# EAGLE design experimental_substrate (EAGLE 9.6.2)
REV: p2; TITLE: Wizard-Architect's Experimental Substrate
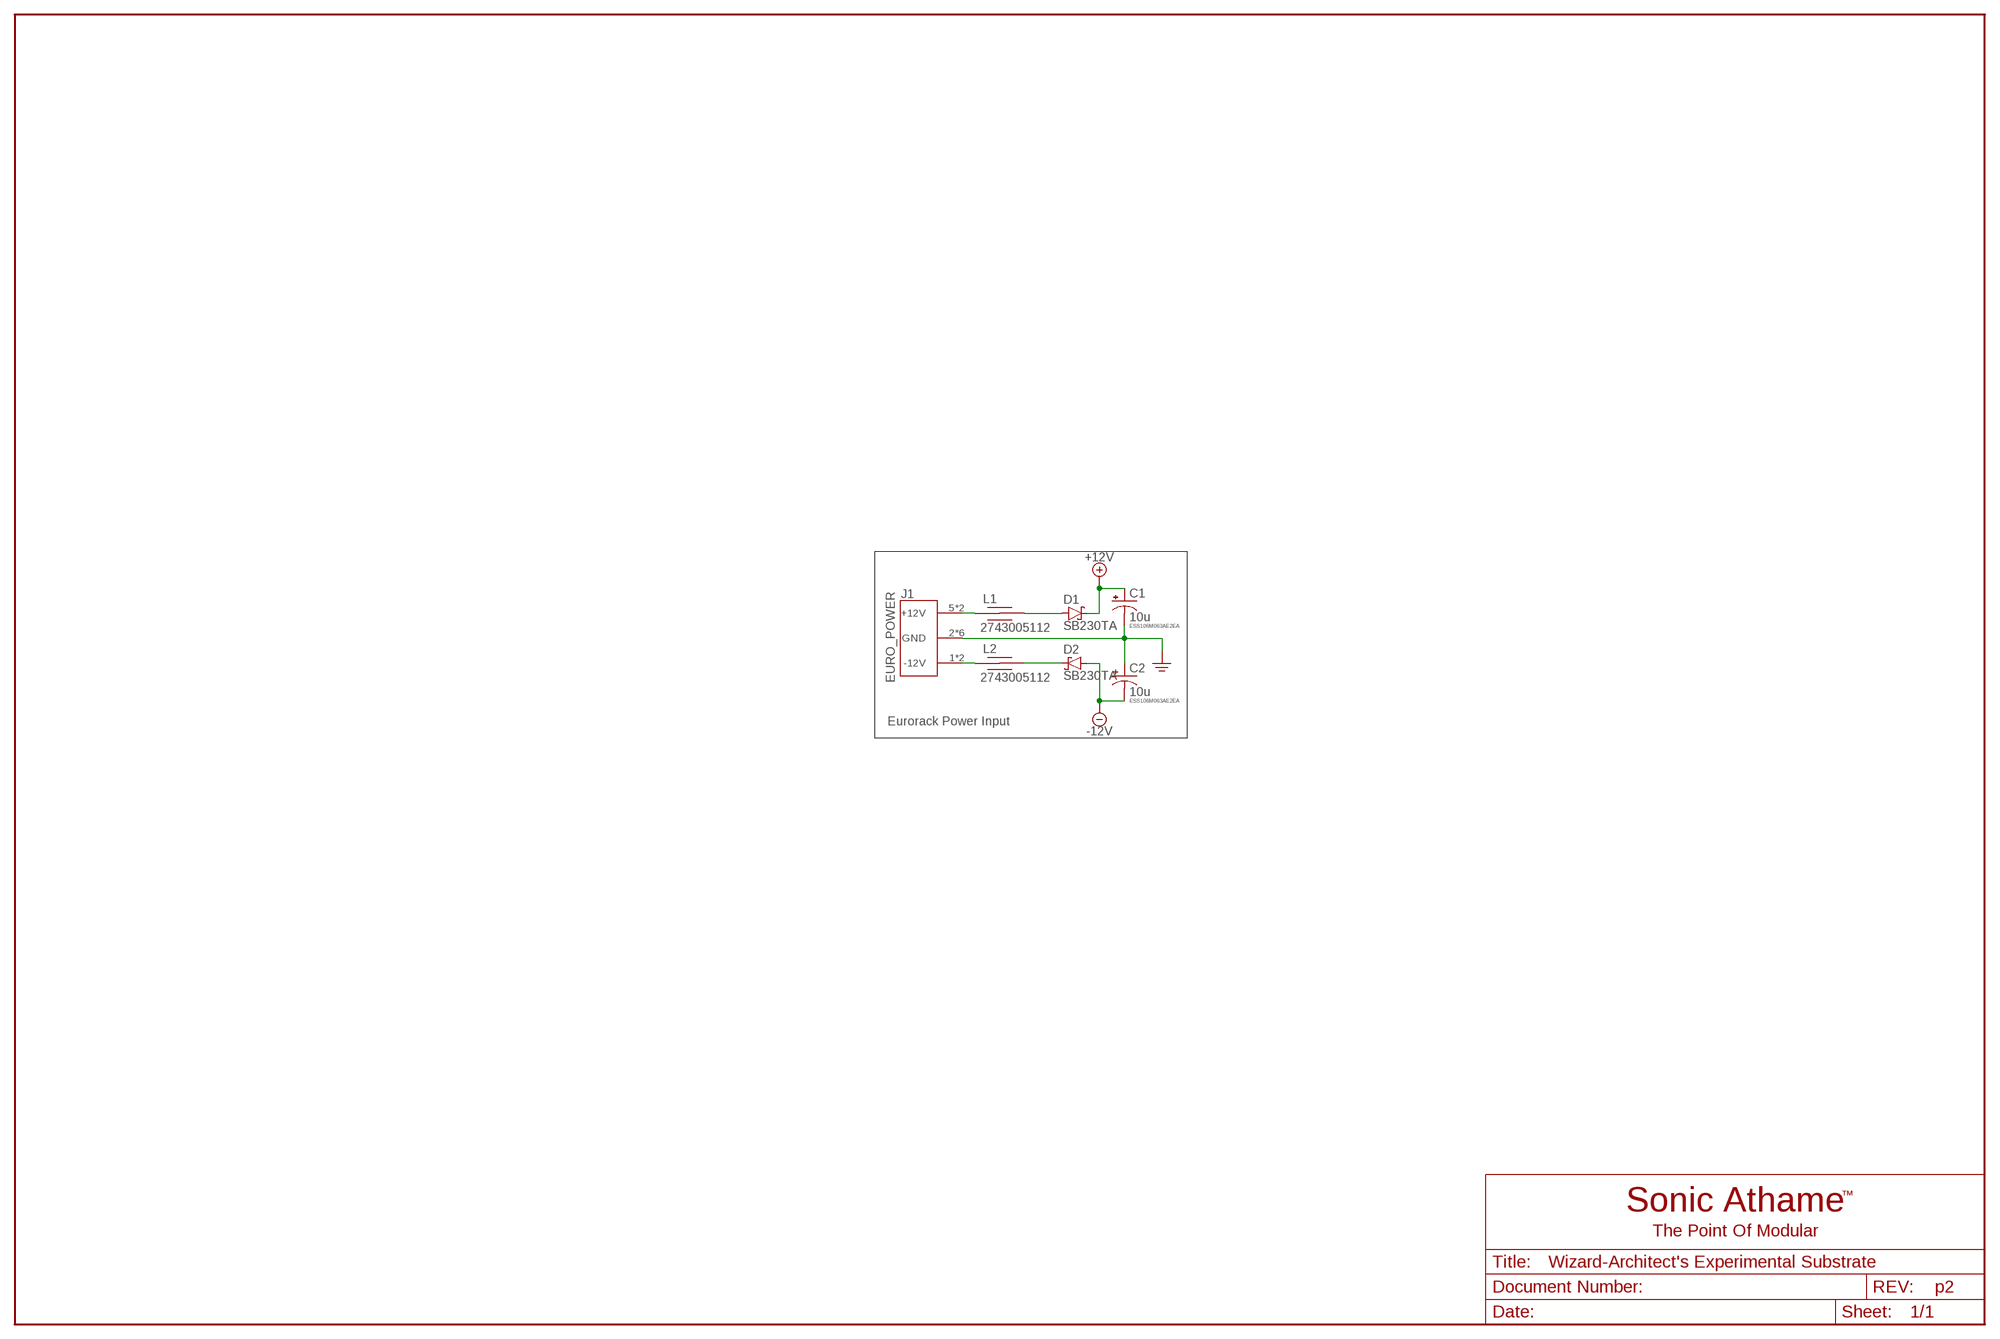
[diagram p0: schematic, sheet 1]

## Parts
C1  10u  CAP_POLLYTIC_V  [TT2D5]
C2  10u  CAP_POLLYTIC_V  [TT2D5]
D1  SB230TA  SCHOTTKY_THT  [0207/2V-POL]
D2  SB230TA  SCHOTTKY_THT  [0207/2V-POL]
J1  EURO_POWER  [EURO_POWER]
L1  2743005112  FERRITE_THT  [0207/2V]
L2  2743005112  FERRITE_THT  [0207/2V]

## Nets
+12V: C1.+ D1.C
-12V: C2.- D2.A
GND: C1.- C2.+ J1.2(GND) J1.3(GND) J1.4(GND) J1.7(GND) J1.8(GND) J1.9(GND)
N$12: D1.A L1.2
N$13: D2.C L2.2
N$14: J1.1(-12V) J1.10(-12V) L2.1
N$15: J1.5(+12V) J1.6(+12V) L1.1

## Notes on the sheet
- ESS106M063AE2EA
- ESS106M063AE2EA
- Eurorack Power Input

## Library data of the parts
C1 C2 = SonicAthame:CAP_POL: POLARIZED CAPACITOR, American symbol
D1 D2 = SonicAthame:SCHOTTKY: THT: SB230TA
J1 = SonicAthame:EURO_POWER
L1 L2 = SonicAthame:FERRITE

## Board
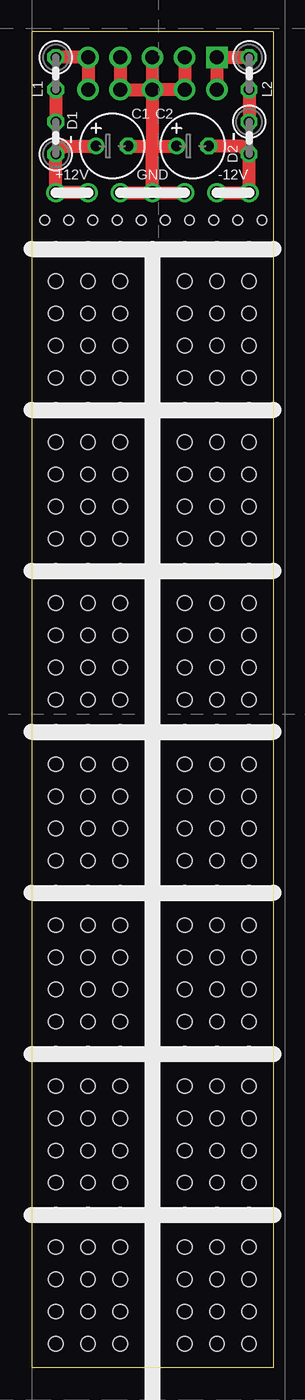
[diagram p1: board, top side]
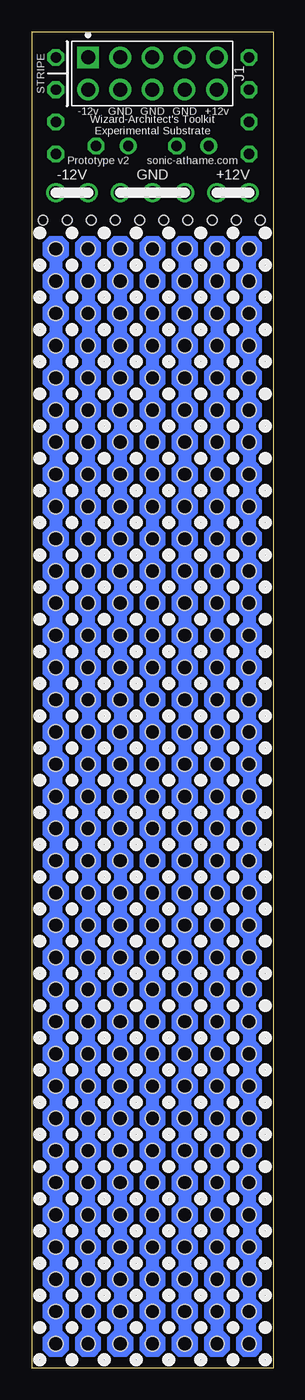
[diagram p2: board, bottom side, seen from below]

Size 19.05 x 105.41 mm. Coordinates in mm from the lower left corner, seen from the top.
Outline: 19.05,105.41 0,105.41 0,0 19.05,0 19.05,105.41
Copper layers (1*16): Top 0.035mm / dielectric 1.5mm / Bottom 0.035mm
Design rules "default *": minimum track width 6mil, minimum drill 0.35mm, track to track 6mil, track to pad 6mil, pad to pad 6mil, via to via 6mil, smd to smd 6mil, copper to edge 0.2mm, drill to drill 6mil, minimum pad ring 10mil, minimum via ring 8mil, stop-mask expansion 4mil, vias tented up to drill 0mil, thermal gap 10mil
Holes 0.76 mm at 1.02,90.55 2.92,90.55 4.83,90.55 6.73,90.55 8.64,90.55 10.54,90.55 12.45,90.55 14.35,90.55 16.26,90.55 18.16,90.55

### Footprints (pad centres in the part's own frame; a part is rotated, then mirrored left to right if it is on the bottom)
TT2D5 = drill 0.813: + -1.27,0 | drill 0.813 octagon: - 1.27,0
0207/2V-POL = drill 0.813 octagon: A 1.27,0; C -1.27,0
EURO_POWER = drill 1.105 pad 1.705 square: 1 -5.08,1.27 | drill 1.105 pad 1.705: 2 -2.54,1.27; 3 0,1.27; 4 2.54,1.27; 5 5.08,1.27; 6 5.08,-1.27; 7 2.54,-1.27; 8 0,-1.27; 9 -2.54,-1.27; 10 -5.08,-1.27
0207/2V = drill 0.813 octagon: 1 -1.27,0; 2 1.27,0
PAD_THT_0.1IN_NONPLATED = hole 1.143: 0,0

### Placement (x,y rotation side)
C1  6.35,96.39 0 top
C2  12.7,96.39 0 top
D1  1.91,97.03 90 top
D2  17.14,97.03 270 top
J1  9.53,102.11 0 bottom
L1  1.91,102.11 270 top
L2  17.14,102.11 270 top
U$1  [PANEL_REF_4U]  0,-12.7 0 top  (outside the outline)
U$2  [PAD_THT_0.1IN_NONPLATED]  14.61,88.27 0 bottom
U$3  [PAD_THT_0.1IN_NONPLATED]  17.14,88.27 0 bottom
U$4  [PAD_THT_0.1IN_NONPLATED]  12.06,88.27 0 bottom
U$5  [PAD_THT_0.1IN_NONPLATED]  9.53,88.27 0 bottom
U$6  [PAD_THT_0.1IN_NONPLATED]  6.99,88.27 0 bottom
U$7  [PAD_THT_0.1IN_NONPLATED]  4.45,88.27 0 bottom
U$8  [PAD_THT_0.1IN_NONPLATED]  1.91,88.27 0 bottom
U$9  [PAD_THT_0.1IN_NONPLATED]  17.14,85.72 0 bottom
U$10  [PAD_THT_0.1IN_NONPLATED]  14.61,85.72 0 bottom
U$11  [PAD_THT_0.1IN_NONPLATED]  12.06,85.72 0 bottom
U$12  [PAD_THT_0.1IN_NONPLATED]  9.53,85.72 0 bottom
U$13  [PAD_THT_0.1IN_NONPLATED]  6.99,85.72 0 bottom
U$14  [PAD_THT_0.1IN_NONPLATED]  4.45,85.72 0 bottom
U$15  [PAD_THT_0.1IN_NONPLATED]  1.91,85.72 0 bottom
U$16  [PAD_THT_0.1IN_NONPLATED]  1.91,83.19 0 bottom
U$17  [PAD_THT_0.1IN_NONPLATED]  4.45,83.19 0 bottom
U$18  [PAD_THT_0.1IN_NONPLATED]  6.99,83.19 0 bottom
U$19  [PAD_THT_0.1IN_NONPLATED]  9.53,83.19 0 bottom
U$20  [PAD_THT_0.1IN_NONPLATED]  12.06,83.19 0 bottom
U$21  [PAD_THT_0.1IN_NONPLATED]  14.61,83.19 0 bottom
U$22  [PAD_THT_0.1IN_NONPLATED]  17.14,83.19 0 bottom
U$23  [PAD_THT_0.1IN_NONPLATED]  17.14,80.64 0 bottom
U$24  [PAD_THT_0.1IN_NONPLATED]  14.61,80.64 0 bottom
U$25  [PAD_THT_0.1IN_NONPLATED]  12.06,80.64 0 bottom
U$26  [PAD_THT_0.1IN_NONPLATED]  9.53,80.64 0 bottom
U$27  [PAD_THT_0.1IN_NONPLATED]  6.99,80.64 0 bottom
U$28  [PAD_THT_0.1IN_NONPLATED]  4.45,80.64 0 bottom
U$29  [PAD_THT_0.1IN_NONPLATED]  1.91,80.64 0 bottom
U$30  [PAD_THT_0.1IN_NONPLATED]  17.14,78.11 0 bottom
U$31  [PAD_THT_0.1IN_NONPLATED]  14.61,78.11 0 bottom
U$32  [PAD_THT_0.1IN_NONPLATED]  12.06,78.11 0 bottom
U$33  [PAD_THT_0.1IN_NONPLATED]  9.53,78.11 0 bottom
U$34  [PAD_THT_0.1IN_NONPLATED]  6.99,78.11 0 bottom
U$35  [PAD_THT_0.1IN_NONPLATED]  4.45,78.11 0 bottom
U$36  [PAD_THT_0.1IN_NONPLATED]  1.91,78.11 0 bottom
U$37  [PAD_THT_0.1IN_NONPLATED]  1.91,75.56 0 bottom
U$38  [PAD_THT_0.1IN_NONPLATED]  4.45,75.56 0 bottom
U$39  [PAD_THT_0.1IN_NONPLATED]  6.99,75.56 0 bottom
U$40  [PAD_THT_0.1IN_NONPLATED]  9.53,75.56 0 bottom
U$41  [PAD_THT_0.1IN_NONPLATED]  12.06,75.56 0 bottom
U$42  [PAD_THT_0.1IN_NONPLATED]  14.61,75.56 0 bottom
U$43  [PAD_THT_0.1IN_NONPLATED]  17.14,75.56 0 bottom
U$44  [PAD_THT_0.1IN_NONPLATED]  17.14,73.02 0 bottom
U$45  [PAD_THT_0.1IN_NONPLATED]  14.61,73.02 0 bottom
U$46  [PAD_THT_0.1IN_NONPLATED]  12.06,73.02 0 bottom
U$47  [PAD_THT_0.1IN_NONPLATED]  9.53,73.02 0 bottom
U$48  [PAD_THT_0.1IN_NONPLATED]  6.99,73.02 0 bottom
U$49  [PAD_THT_0.1IN_NONPLATED]  4.45,73.02 0 bottom
U$50  [PAD_THT_0.1IN_NONPLATED]  1.91,73.02 0 bottom
U$51  [PAD_THT_0.1IN_NONPLATED]  17.14,70.48 0 bottom
U$52  [PAD_THT_0.1IN_NONPLATED]  14.61,70.48 0 bottom
U$53  [PAD_THT_0.1IN_NONPLATED]  12.06,70.48 0 bottom
U$54  [PAD_THT_0.1IN_NONPLATED]  9.53,70.48 0 bottom
U$55  [PAD_THT_0.1IN_NONPLATED]  6.99,70.48 0 bottom
U$56  [PAD_THT_0.1IN_NONPLATED]  4.45,70.48 0 bottom
U$57  [PAD_THT_0.1IN_NONPLATED]  1.91,70.48 0 bottom
U$58  [PAD_THT_0.1IN_NONPLATED]  1.91,67.94 0 bottom
U$59  [PAD_THT_0.1IN_NONPLATED]  4.45,67.94 0 bottom
U$60  [PAD_THT_0.1IN_NONPLATED]  6.99,67.94 0 bottom
U$61  [PAD_THT_0.1IN_NONPLATED]  9.53,67.94 0 bottom
U$62  [PAD_THT_0.1IN_NONPLATED]  12.06,67.94 0 bottom
U$63  [PAD_THT_0.1IN_NONPLATED]  14.61,67.94 0 bottom
U$64  [PAD_THT_0.1IN_NONPLATED]  17.14,67.94 0 bottom
U$65  [PAD_THT_0.1IN_NONPLATED]  17.14,65.41 0 bottom
U$66  [PAD_THT_0.1IN_NONPLATED]  14.61,65.41 0 bottom
U$67  [PAD_THT_0.1IN_NONPLATED]  12.06,65.41 0 bottom
U$68  [PAD_THT_0.1IN_NONPLATED]  9.53,65.41 0 bottom
U$69  [PAD_THT_0.1IN_NONPLATED]  6.99,65.41 0 bottom
U$70  [PAD_THT_0.1IN_NONPLATED]  4.45,65.41 0 bottom
U$71  [PAD_THT_0.1IN_NONPLATED]  1.91,65.41 0 bottom
U$72  [PAD_THT_0.1IN_NONPLATED]  17.14,62.86 0 bottom
U$73  [PAD_THT_0.1IN_NONPLATED]  14.61,62.86 0 bottom
U$74  [PAD_THT_0.1IN_NONPLATED]  12.06,62.86 0 bottom
U$75  [PAD_THT_0.1IN_NONPLATED]  9.53,62.86 0 bottom
U$76  [PAD_THT_0.1IN_NONPLATED]  6.99,62.86 0 bottom
U$77  [PAD_THT_0.1IN_NONPLATED]  4.45,62.86 0 bottom
U$78  [PAD_THT_0.1IN_NONPLATED]  1.91,62.86 0 bottom
U$79  [PAD_THT_0.1IN_NONPLATED]  1.91,60.33 0 bottom
U$80  [PAD_THT_0.1IN_NONPLATED]  4.45,60.33 0 bottom
U$81  [PAD_THT_0.1IN_NONPLATED]  6.99,60.33 0 bottom
U$82  [PAD_THT_0.1IN_NONPLATED]  9.53,60.33 0 bottom
U$83  [PAD_THT_0.1IN_NONPLATED]  12.06,60.33 0 bottom
U$84  [PAD_THT_0.1IN_NONPLATED]  14.61,60.33 0 bottom
U$85  [PAD_THT_0.1IN_NONPLATED]  17.14,60.33 0 bottom
U$86  [PAD_THT_0.1IN_NONPLATED]  17.14,57.78 0 bottom
U$87  [PAD_THT_0.1IN_NONPLATED]  14.61,57.78 0 bottom
U$88  [PAD_THT_0.1IN_NONPLATED]  12.06,57.78 0 bottom
U$89  [PAD_THT_0.1IN_NONPLATED]  9.53,57.78 0 bottom
U$90  [PAD_THT_0.1IN_NONPLATED]  6.99,57.78 0 bottom
U$91  [PAD_THT_0.1IN_NONPLATED]  4.45,57.78 0 bottom
U$92  [PAD_THT_0.1IN_NONPLATED]  1.91,57.78 0 bottom
U$93  [PAD_THT_0.1IN_NONPLATED]  17.14,55.24 0 bottom
U$94  [PAD_THT_0.1IN_NONPLATED]  14.61,55.24 0 bottom
U$95  [PAD_THT_0.1IN_NONPLATED]  12.06,55.24 0 bottom
U$96  [PAD_THT_0.1IN_NONPLATED]  9.53,55.24 0 bottom
U$97  [PAD_THT_0.1IN_NONPLATED]  6.99,55.24 0 bottom
U$98  [PAD_THT_0.1IN_NONPLATED]  4.45,55.24 0 bottom
U$99  [PAD_THT_0.1IN_NONPLATED]  1.91,55.24 0 bottom
U$100  [PAD_THT_0.1IN_NONPLATED]  1.91,52.7 0 bottom
U$101  [PAD_THT_0.1IN_NONPLATED]  4.45,52.7 0 bottom
U$102  [PAD_THT_0.1IN_NONPLATED]  6.99,52.7 0 bottom
U$103  [PAD_THT_0.1IN_NONPLATED]  9.53,52.7 0 bottom
U$104  [PAD_THT_0.1IN_NONPLATED]  12.06,52.7 0 bottom
U$105  [PAD_THT_0.1IN_NONPLATED]  14.61,52.7 0 bottom
U$106  [PAD_THT_0.1IN_NONPLATED]  17.14,52.7 0 bottom
U$107  [PAD_THT_0.1IN_NONPLATED]  17.14,50.17 0 bottom
U$108  [PAD_THT_0.1IN_NONPLATED]  14.61,50.17 0 bottom
U$109  [PAD_THT_0.1IN_NONPLATED]  12.06,50.17 0 bottom
U$110  [PAD_THT_0.1IN_NONPLATED]  9.53,50.17 0 bottom
U$111  [PAD_THT_0.1IN_NONPLATED]  6.99,50.17 0 bottom
U$112  [PAD_THT_0.1IN_NONPLATED]  4.45,50.17 0 bottom
U$113  [PAD_THT_0.1IN_NONPLATED]  1.91,50.17 0 bottom
U$114  [PAD_THT_0.1IN_NONPLATED]  17.14,47.62 0 bottom
U$115  [PAD_THT_0.1IN_NONPLATED]  14.61,47.62 0 bottom
U$116  [PAD_THT_0.1IN_NONPLATED]  12.06,47.62 0 bottom
U$117  [PAD_THT_0.1IN_NONPLATED]  9.53,47.62 0 bottom
U$118  [PAD_THT_0.1IN_NONPLATED]  6.99,47.62 0 bottom
U$119  [PAD_THT_0.1IN_NONPLATED]  4.45,47.62 0 bottom
U$120  [PAD_THT_0.1IN_NONPLATED]  1.91,47.62 0 bottom
U$121  [PAD_THT_0.1IN_NONPLATED]  1.91,45.08 0 bottom
U$122  [PAD_THT_0.1IN_NONPLATED]  4.45,45.08 0 bottom
U$123  [PAD_THT_0.1IN_NONPLATED]  6.99,45.08 0 bottom
U$124  [PAD_THT_0.1IN_NONPLATED]  9.53,45.08 0 bottom
U$125  [PAD_THT_0.1IN_NONPLATED]  12.06,45.08 0 bottom
U$126  [PAD_THT_0.1IN_NONPLATED]  14.61,45.08 0 bottom
U$127  [PAD_THT_0.1IN_NONPLATED]  17.14,45.08 0 bottom
U$128  [PAD_THT_0.1IN_NONPLATED]  17.14,42.55 0 bottom
U$129  [PAD_THT_0.1IN_NONPLATED]  14.61,42.55 0 bottom
U$130  [PAD_THT_0.1IN_NONPLATED]  12.06,42.55 0 bottom
U$131  [PAD_THT_0.1IN_NONPLATED]  9.53,42.55 0 bottom
U$132  [PAD_THT_0.1IN_NONPLATED]  6.99,42.55 0 bottom
U$133  [PAD_THT_0.1IN_NONPLATED]  4.45,42.55 0 bottom
U$134  [PAD_THT_0.1IN_NONPLATED]  1.91,42.55 0 bottom
U$135  [PAD_THT_0.1IN_NONPLATED]  17.14,40 0 bottom
U$136  [PAD_THT_0.1IN_NONPLATED]  14.61,40 0 bottom
U$137  [PAD_THT_0.1IN_NONPLATED]  12.06,40 0 bottom
U$138  [PAD_THT_0.1IN_NONPLATED]  9.53,40 0 bottom
U$139  [PAD_THT_0.1IN_NONPLATED]  6.99,40 0 bottom
U$140  [PAD_THT_0.1IN_NONPLATED]  4.45,40 0 bottom
U$141  [PAD_THT_0.1IN_NONPLATED]  1.91,40 0 bottom
U$142  [PAD_THT_0.1IN_NONPLATED]  1.91,37.47 0 bottom
U$143  [PAD_THT_0.1IN_NONPLATED]  4.45,37.47 0 bottom
U$144  [PAD_THT_0.1IN_NONPLATED]  6.99,37.47 0 bottom
U$145  [PAD_THT_0.1IN_NONPLATED]  9.53,37.47 0 bottom
U$146  [PAD_THT_0.1IN_NONPLATED]  12.06,37.47 0 bottom
U$147  [PAD_THT_0.1IN_NONPLATED]  14.61,37.47 0 bottom
U$148  [PAD_THT_0.1IN_NONPLATED]  17.14,37.47 0 bottom
U$149  [PAD_THT_0.1IN_NONPLATED]  17.14,34.92 0 bottom
U$150  [PAD_THT_0.1IN_NONPLATED]  14.61,34.92 0 bottom
U$151  [PAD_THT_0.1IN_NONPLATED]  12.06,34.92 0 bottom
U$152  [PAD_THT_0.1IN_NONPLATED]  9.53,34.92 0 bottom
U$153  [PAD_THT_0.1IN_NONPLATED]  6.99,34.92 0 bottom
U$154  [PAD_THT_0.1IN_NONPLATED]  4.45,34.92 0 bottom
U$155  [PAD_THT_0.1IN_NONPLATED]  1.91,34.92 0 bottom
U$156  [PAD_THT_0.1IN_NONPLATED]  17.14,32.39 0 bottom
U$157  [PAD_THT_0.1IN_NONPLATED]  14.61,32.39 0 bottom
U$158  [PAD_THT_0.1IN_NONPLATED]  12.06,32.39 0 bottom
U$159  [PAD_THT_0.1IN_NONPLATED]  9.53,32.39 0 bottom
U$160  [PAD_THT_0.1IN_NONPLATED]  6.99,32.39 0 bottom
U$161  [PAD_THT_0.1IN_NONPLATED]  4.45,32.39 0 bottom
U$162  [PAD_THT_0.1IN_NONPLATED]  1.91,32.39 0 bottom
U$163  [PAD_THT_0.1IN_NONPLATED]  1.91,29.85 0 bottom
U$164  [PAD_THT_0.1IN_NONPLATED]  4.45,29.85 0 bottom
U$165  [PAD_THT_0.1IN_NONPLATED]  6.99,29.85 0 bottom
U$166  [PAD_THT_0.1IN_NONPLATED]  9.53,29.85 0 bottom
U$167  [PAD_THT_0.1IN_NONPLATED]  12.06,29.85 0 bottom
U$168  [PAD_THT_0.1IN_NONPLATED]  14.61,29.85 0 bottom
U$169  [PAD_THT_0.1IN_NONPLATED]  17.14,29.85 0 bottom
U$170  [PAD_THT_0.1IN_NONPLATED]  17.14,27.31 0 bottom
U$171  [PAD_THT_0.1IN_NONPLATED]  14.61,27.31 0 bottom
U$172  [PAD_THT_0.1IN_NONPLATED]  12.06,27.31 0 bottom
U$173  [PAD_THT_0.1IN_NONPLATED]  9.53,27.31 0 bottom
U$174  [PAD_THT_0.1IN_NONPLATED]  6.99,27.31 0 bottom
U$175  [PAD_THT_0.1IN_NONPLATED]  4.45,27.31 0 bottom
U$176  [PAD_THT_0.1IN_NONPLATED]  1.91,27.31 0 bottom
U$177  [PAD_THT_0.1IN_NONPLATED]  17.14,24.77 0 bottom
U$178  [PAD_THT_0.1IN_NONPLATED]  14.61,24.77 0 bottom
U$179  [PAD_THT_0.1IN_NONPLATED]  12.06,24.77 0 bottom
U$180  [PAD_THT_0.1IN_NONPLATED]  9.53,24.77 0 bottom
U$181  [PAD_THT_0.1IN_NONPLATED]  6.99,24.77 0 bottom
U$182  [PAD_THT_0.1IN_NONPLATED]  4.45,24.77 0 bottom
U$183  [PAD_THT_0.1IN_NONPLATED]  1.91,24.77 0 bottom
U$184  [PAD_THT_0.1IN_NONPLATED]  1.91,22.22 0 bottom
U$185  [PAD_THT_0.1IN_NONPLATED]  4.45,22.22 0 bottom
U$186  [PAD_THT_0.1IN_NONPLATED]  6.99,22.22 0 bottom
U$187  [PAD_THT_0.1IN_NONPLATED]  9.53,22.22 0 bottom
U$188  [PAD_THT_0.1IN_NONPLATED]  12.06,22.22 0 bottom
U$189  [PAD_THT_0.1IN_NONPLATED]  14.61,22.22 0 bottom
U$190  [PAD_THT_0.1IN_NONPLATED]  17.14,22.22 0 bottom
U$191  [PAD_THT_0.1IN_NONPLATED]  17.14,19.68 0 bottom
U$192  [PAD_THT_0.1IN_NONPLATED]  14.61,19.68 0 bottom
U$193  [PAD_THT_0.1IN_NONPLATED]  12.06,19.68 0 bottom
U$194  [PAD_THT_0.1IN_NONPLATED]  9.53,19.68 0 bottom
U$195  [PAD_THT_0.1IN_NONPLATED]  6.99,19.68 0 bottom
U$196  [PAD_THT_0.1IN_NONPLATED]  4.45,19.68 0 bottom
U$197  [PAD_THT_0.1IN_NONPLATED]  1.91,19.68 0 bottom
U$198  [PAD_THT_0.1IN_NONPLATED]  17.14,17.14 0 bottom
U$199  [PAD_THT_0.1IN_NONPLATED]  14.61,17.14 0 bottom
U$200  [PAD_THT_0.1IN_NONPLATED]  12.06,17.14 0 bottom
U$201  [PAD_THT_0.1IN_NONPLATED]  9.53,17.14 0 bottom
U$202  [PAD_THT_0.1IN_NONPLATED]  6.99,17.14 0 bottom
U$203  [PAD_THT_0.1IN_NONPLATED]  4.45,17.14 0 bottom
U$204  [PAD_THT_0.1IN_NONPLATED]  1.91,17.14 0 bottom
U$205  [PAD_THT_0.1IN_NONPLATED]  1.91,14.61 0 bottom
U$206  [PAD_THT_0.1IN_NONPLATED]  4.45,14.61 0 bottom
U$207  [PAD_THT_0.1IN_NONPLATED]  6.99,14.61 0 bottom
U$208  [PAD_THT_0.1IN_NONPLATED]  9.53,14.61 0 bottom
U$209  [PAD_THT_0.1IN_NONPLATED]  12.06,14.61 0 bottom
U$210  [PAD_THT_0.1IN_NONPLATED]  14.61,14.61 0 bottom
U$211  [PAD_THT_0.1IN_NONPLATED]  17.14,14.61 0 bottom
U$212  [PAD_THT_0.1IN_NONPLATED]  17.14,12.07 0 bottom
U$213  [PAD_THT_0.1IN_NONPLATED]  14.61,12.07 0 bottom
U$214  [PAD_THT_0.1IN_NONPLATED]  12.06,12.07 0 bottom
U$215  [PAD_THT_0.1IN_NONPLATED]  9.53,12.07 0 bottom
U$216  [PAD_THT_0.1IN_NONPLATED]  6.99,12.07 0 bottom
U$217  [PAD_THT_0.1IN_NONPLATED]  4.45,12.07 0 bottom
U$218  [PAD_THT_0.1IN_NONPLATED]  1.91,12.07 0 bottom
U$219  [PAD_THT_0.1IN_NONPLATED]  17.14,9.53 0 bottom
U$220  [PAD_THT_0.1IN_NONPLATED]  14.61,9.53 0 bottom
U$221  [PAD_THT_0.1IN_NONPLATED]  12.06,9.53 0 bottom
U$222  [PAD_THT_0.1IN_NONPLATED]  9.53,9.53 0 bottom
U$223  [PAD_THT_0.1IN_NONPLATED]  6.99,9.53 0 bottom
U$224  [PAD_THT_0.1IN_NONPLATED]  4.45,9.53 0 bottom
U$225  [PAD_THT_0.1IN_NONPLATED]  1.91,9.53 0 bottom
U$226  [PAD_THT_0.1IN_NONPLATED]  1.91,6.98 0 bottom
U$227  [PAD_THT_0.1IN_NONPLATED]  4.45,6.98 0 bottom
U$228  [PAD_THT_0.1IN_NONPLATED]  6.99,6.98 0 bottom
U$229  [PAD_THT_0.1IN_NONPLATED]  9.53,6.98 0 bottom
U$230  [PAD_THT_0.1IN_NONPLATED]  12.06,6.98 0 bottom
U$231  [PAD_THT_0.1IN_NONPLATED]  14.61,6.98 0 bottom
U$232  [PAD_THT_0.1IN_NONPLATED]  17.14,6.98 0 bottom
U$233  [PAD_THT_0.1IN_NONPLATED]  17.14,4.45 0 bottom
U$234  [PAD_THT_0.1IN_NONPLATED]  14.61,4.45 0 bottom
U$235  [PAD_THT_0.1IN_NONPLATED]  12.06,4.45 0 bottom
U$236  [PAD_THT_0.1IN_NONPLATED]  9.53,4.45 0 bottom
U$237  [PAD_THT_0.1IN_NONPLATED]  6.99,4.45 0 bottom
U$238  [PAD_THT_0.1IN_NONPLATED]  4.45,4.45 0 bottom
U$239  [PAD_THT_0.1IN_NONPLATED]  1.91,4.45 0 bottom
U$240  [PAD_THT_0.1IN_NONPLATED]  17.14,1.91 0 bottom
U$241  [PAD_THT_0.1IN_NONPLATED]  14.61,1.91 0 bottom
U$242  [PAD_THT_0.1IN_NONPLATED]  12.06,1.91 0 bottom
U$243  [PAD_THT_0.1IN_NONPLATED]  9.53,1.91 0 bottom
U$244  [PAD_THT_0.1IN_NONPLATED]  6.99,1.91 0 bottom
U$245  [PAD_THT_0.1IN_NONPLATED]  4.45,1.91 0 bottom
U$246  [PAD_THT_0.1IN_NONPLATED]  1.91,1.91 0 bottom
U$247  [LOGO-65MIL-TBARE]  6.99,83.82 45 top
U$249  [LOGO-65MIL-TBARE]  16.51,83.82 45 top
U$250  [LOGO-65MIL-TBARE]  -2.54,83.82 45 top
U$251  [LOGO-65MIL-TBARE]  4.45,71.75 45 top
U$252  [LOGO-65MIL-TBARE]  -5.08,71.75 45 top  (outside the outline)
U$253  [LOGO-65MIL-TBARE]  13.97,71.75 45 top
U$254  [LOGO-65MIL-TBARE]  23.5,71.75 45 top  (outside the outline)
U$255  [LOGO-65MIL-TBARE]  1.91,59.69 45 top
U$256  [LOGO-65MIL-TBARE]  11.43,59.69 45 top
U$257  [LOGO-65MIL-TBARE]  20.95,59.69 45 top
U$258  [LOGO-65MIL-TBARE]  8.89,47.62 45 top
U$259  [LOGO-65MIL-TBARE]  -0.64,47.62 45 top
U$260  [LOGO-65MIL-TBARE]  18.41,47.62 45 top
U$261  [LOGO-65MIL-TBARE]  6.35,35.56 45 top
U$262  [LOGO-65MIL-TBARE]  -3.17,35.56 45 top  (outside the outline)
U$263  [LOGO-65MIL-TBARE]  15.88,35.56 45 top
U$264  [LOGO-65MIL-TBARE]  3.81,23.5 45 top
U$265  [LOGO-65MIL-TBARE]  -5.71,23.5 45 top  (outside the outline)
U$266  [LOGO-65MIL-TBARE]  13.34,23.5 45 top
U$267  [LOGO-65MIL-TBARE]  22.86,23.5 45 top  (outside the outline)
U$268  [LOGO-65MIL-TBARE]  1.27,11.43 45 top
U$269  [LOGO-65MIL-TBARE]  10.79,11.43 45 top
U$270  [LOGO-65MIL-TBARE]  20.32,11.43 45 top
U$271  [LOGO-65MIL-TBARE]  8.26,-0.63 45 top
U$272  [LOGO-65MIL-TBARE]  -1.27,-0.63 45 top
U$273  [LOGO-65MIL-TBARE]  17.78,-0.63 45 top

### Tracks (layer width: path | path; a pad name or v marks a point on that pad's centre or on a via)
+12V  (via drill 1.02)
  Top 1.016: C1.+ 2.54,96.39 D1.C v1.91,92.71 v4.45,92.71
-12V  (via drill 1.02)
  Top 1.016: v14.61,92.71 v17.14,92.71 D2.A 16.51,96.39 C2.-
GND  (via drill 1.02)
  Top 1.016: v9.53,92.71 v12.06,92.71 | v6.99,92.71 v9.53,92.71 | J1.4 J1.7 J1.8 | J1.2 J1.9 J1.8 | J1.3 J1.8 | J1.8 9.53,96.39 | 9.53,96.39 C2.+ | C1.- 9.53,96.39 | v9.53,92.71 9.53,96.39
N$1
  Bottom 1.016: 1.91,88.27 1.91,1.91
N$2
  Bottom 1.016: 4.45,88.27 4.45,1.91
N$3
  Bottom 1.016: 6.99,88.27 6.99,1.91
N$4
  Bottom 1.016: 9.53,88.27 9.53,1.91
N$5
  Bottom 1.016: 12.06,88.27 12.06,1.91
N$6
  Bottom 1.016: 14.61,88.27 14.61,1.91
N$7
  Bottom 1.016: 17.14,88.27 17.14,1.91
N$12
  Top 1.016: L1.2 D1.A
N$13
  Top 1.016: L2.2 D2.C
N$14
  Top 1.016: J1.10 J1.1 L2.1
N$15
  Top 1.016: J1.6 J1.5 L1.1

### Text on the board
tNames: +12V | GND | -12V
bNames: STRIPE | Wizard-Architect's Toolkit / Experimental Substrate | sonic-athame.com | Prototype v2 | +12V | GND | -12V